# Altium schematic sheet MCU.schdoc
size A4
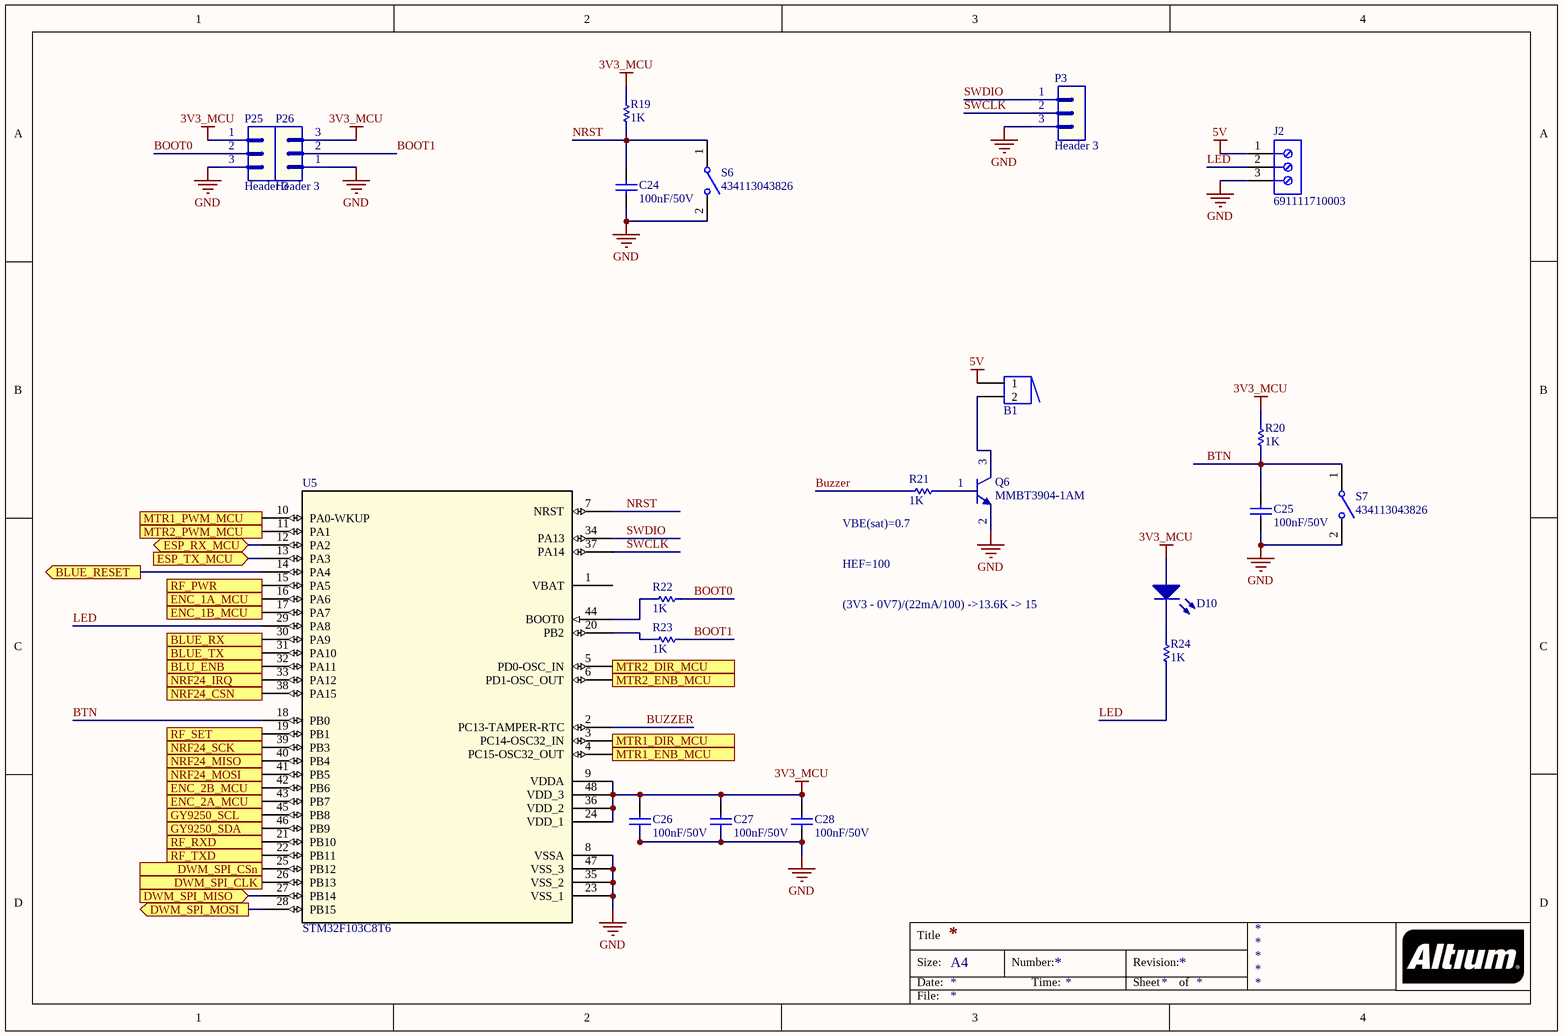
[diagram p0: MCU.schdoc]

## Parts
B1  Buzzer  [BUZZER]  (value not drawn)
C24  value 100nF/50V  [CAP-SM-0805]  (hidden comment: Cap-100nF-50V-0805)
C25  value 100nF/50V  [CAP-SM-0805]  (hidden comment: Cap-100nF-50V-0805)
C26  value 100nF/50V  [CAP-SM-0805]  (hidden comment: Cap-100nF-50V-0805)
C27  value 100nF/50V  [CAP-SM-0805]  (hidden comment: Cap-100nF-50V-0805)
C28  value 100nF/50V  [CAP-SM-0805]  (hidden comment: Cap-100nF-50V-0805)
D10  LED  [LED_0805_Blue]  (value not drawn)
J2  691111710003  [691111710003]
P3  Header 3  [JP3]
P25  Header 3  [JP3]
P26  Header 3  [JP3]
Q6  MMBT3904-1AM  [SOT23_NEX]
R19  value 1K  [RES-SM-0805]  (hidden comment: Resistor 1/4W)
R20  value 1K  [RES-SM-0805]  (hidden comment: Resistor 1/4W)
R21  value 1K  [RES-SM-0805]  (hidden comment: Resistor 1/4W)
R22  value 1K  [RES-SM-0805]  (hidden comment: Resistor 1/4W)
R23  value 1K  [RES-SM-0805]  (hidden comment: Resistor 1/4W)
R24  value 1K  [RES-SM-0805]  (hidden comment: Resistor 1/4W)
S6  434113043826  [434113043826]
S7  434113043826  [434113043826]
U5  STM32F103C8T6

## Ports
BLU_ENB (out), BLUE_RESET (out), BLUE_RX (out), BLUE_TX (in), DWM_SPI_CLK (out), DWM_SPI_CSn (out), DWM_SPI_MISO (in), DWM_SPI_MOSI (out), ENC_1A_MCU (in), ENC_1B_MCU (in), ENC_2A_MCU, ENC_2B_MCU, ESP_RX_MCU (bidir), ESP_TX_MCU (in), GY9250_SCL (out), GY9250_SDA (out), MTR1_DIR_MCU (out), MTR1_ENB_MCU (out), MTR1_PWM_MCU (out), MTR2_DIR_MCU (out), MTR2_ENB_MCU (out), MTR2_PWM_MCU (out), NRF24_CSN (out), NRF24_IRQ (in), NRF24_MISO (in), NRF24_MOSI (out), NRF24_SCK (out), RF_PWR (out), RF_RXD (out), RF_SET (out), RF_TXD (in)

## Nets
3V3_MCU: C26.2 C27.2 C28.2 D10.1(A) P25.1 P26.3 R19.2 R20.2 U5.9(VDDA) U5.24(VDD_1) U5.36(VDD_2) U5.48(VDD_3)
5V: B1.1 J2.1
GND: C24.1 C25.1 C26.1 C27.1 C28.1 J2.3 P3.3 P25.3 P26.1 Q6.2(E) S6.2 S7.2 U5.8(VSSA) U5.23(VSS_1) U5.35(VSS_2) U5.47(VSS_3)
BLU_ENB: U5.32(PA11) ; port BLU_ENB
BLUE_RESET: U5.14(PA4) ; port BLUE_RESET
BLUE_RX: U5.30(PA9) ; port BLUE_RX
BLUE_TX: U5.31(PA10) ; port BLUE_TX
BOOT0: P25.2 R22.1
BOOT1: P26.2 R23.1
BTN: C25.2 R20.1 S7.1 U5.18(PB0)
Buzzer: R21.2 U5.2(PC13-TAMPER-RTC)
DWM_SPI_CLK: U5.26(PB13) ; port DWM_SPI_CLK
DWM_SPI_CSn: U5.25(PB12) ; port DWM_SPI_CSn
DWM_SPI_MISO: U5.27(PB14) ; port DWM_SPI_MISO
DWM_SPI_MOSI: U5.28(PB15) ; port DWM_SPI_MOSI
ENC_1A_MCU: U5.16(PA6) ; port ENC_1A_MCU
ENC_1B_MCU: U5.17(PA7) ; port ENC_1B_MCU
ENC_2A_MCU: U5.43(PB7) ; port ENC_2A_MCU
ENC_2B_MCU: U5.42(PB6) ; port ENC_2B_MCU
ESP_RX_MCU: U5.12(PA2) ; port ESP_RX_MCU
ESP_TX_MCU: U5.13(PA3) ; port ESP_TX_MCU
GY9250_SCL: U5.45(PB8) ; port GY9250_SCL
GY9250_SDA: U5.46(PB9) ; port GY9250_SDA
LED: J2.2 R24.1 U5.29(PA8)
MTR1_DIR_MCU: U5.3(PC14-OSC32_IN) ; port MTR1_DIR_MCU
MTR1_ENB_MCU: U5.4(PC15-OSC32_OUT) ; port MTR1_ENB_MCU
MTR1_PWM_MCU: U5.10(PA0-WKUP) ; port MTR1_PWM_MCU
MTR2_DIR_MCU: U5.5(PD0-OSC_IN) ; port MTR2_DIR_MCU
MTR2_ENB_MCU: U5.6(PD1-OSC_OUT) ; port MTR2_ENB_MCU
MTR2_PWM_MCU: U5.11(PA1) ; port MTR2_PWM_MCU
NRF24_CSN: U5.38(PA15) ; port NRF24_CSN
NRF24_IRQ: U5.33(PA12) ; port NRF24_IRQ
NRF24_MISO: U5.40(PB4) ; port NRF24_MISO
NRF24_MOSI: U5.41(PB5) ; port NRF24_MOSI
NRF24_SCK: U5.39(PB3) ; port NRF24_SCK
NRST: C24.2 R19.1 S6.1 U5.7(NRST)
RF_PWR: U5.15(PA5) ; port RF_PWR
RF_RXD: U5.21(PB10) ; port RF_RXD
RF_SET: U5.19(PB1) ; port RF_SET
RF_TXD: U5.22(PB11) ; port RF_TXD
SWCLK: P3.2 U5.37(PA14)
SWDIO: P3.1 U5.34(PA13)
NetB1_2: B1.2 Q6.3(C)
NetD10_2: D10.2(K) R24.2
NetQ6_1: Q6.1(B) R21.1
NetR22_2: R22.2 U5.44(BOOT0)
NetR23_2: R23.2 U5.20(PB2)

Not connected (* = marked no-connect by the designer): U5 1(VBAT)

## Notes on the sheet
- (near R21) VBE(sat)=0.7
- HEF=100
- (3V3 - 0V7)/(22mA/100) ->13.6K -> 15
- Title
- Size:
- Date:
- A4
- Number:
- Time:
- Revision:
- Sheet
- of
- File:

## Library data of the parts
C24-C28 = Cap-100nF-50V-0805: CAP CER 0.1UF 50V Y5V 0805; Manufacturer: Samsung Electro-Mechanics; Manufacturer Part Number: CL21F104ZBCNNNC; Local Supplier: thegioiic; Local Supplier Link: https://thegioiic.com/products/tu-100nf-0-1uf-50v-0805; Supplier 1: Digikey; Supplier 1 Part Number: 1276-1007-1-ND; Supplier 1 Link: https://www.digikey.com/product-detail/en/samsung-electro-mechanics/CL21F104ZBCNNNC/1276-1007-1-ND/3889093
J2 = 691111710003: WR-TBL Serie 111 Horizontal Entry Modular, Pressure Clamp, pitch 5mm, 3p; Compliance: Lead free / RoHS; Modularity: Yes; PCB/Cable/Panel: PCB; Pin Number: 3; Rated Current [UL]: 15A; Working Voltage [UL]: 250VAC; ComponentLink1Description: Manufacturer; ComponentLink1URL: http://www.we-online.de; ComponentLink2URL: https://katalog.we-online.de/em/datasheet/691111710003.pdf; ComponentLink2Description: Datasheet; Mounting Technology: THT; Part Number: 691111710003; Packaging: Box; Operating Temperature: -40 to +105degC; Pitch: 5mm; Published Date: October 2019; Type: Horizontal; Publisher: Wurth Elektronik; Application: Pressure Clamp
P3 P25 P26 = Header 3: Header, 3-Pin; LatestRevisionDate: 17-Jul-2002; LatestRevisionNote: Re-released for DXP Platform.; Publisher: Altium Limited
R19-R24 = RES
S6 S7 = 434113043826: WS-TASV J-Bend SMT Tact Switch 6x3.5mm, height 4.3mm, 260gf; Rated Voltage: 12VDC; Rated Current: 50mA; Washable: No; ComponentLink1Description: Manufacturer; ComponentLink1URL: http://www.we-online.de; ComponentLink2Description: Datasheet; ComponentLink2URL: https://katalog.we-online.com/em/datasheet/434113043826.pdf; Operating Temperature: -40 to +85degC; Part Number: 434113043826; Published Date: September 2019; Contact Material: Stainless Steel; Height: 4.3mm; Mounting Technology: SMT; Contact Plating: Silver; Operation Force: 260gf; Packaging: Tape and Reel; Terminal Material: Copper Alloy; Publisher: Wurth Elektronik; Terminal Plating: Silver
U5 = STM32F103C8T6: No Description Available; SourceLibrary: StMicro_2011-06-07; Built_By: EMA_UL_Team; Vendor: STMicroelectronics; Manufacturer_Part_Number: STM32F103C8T6; Copyright: Copyright (C) 2018 Accelerated Designs. All rights reserved; RefDes: RefDes; Type: DEV